# Altium schematic sheet JIANGYA.SchDoc
size OrCAD E
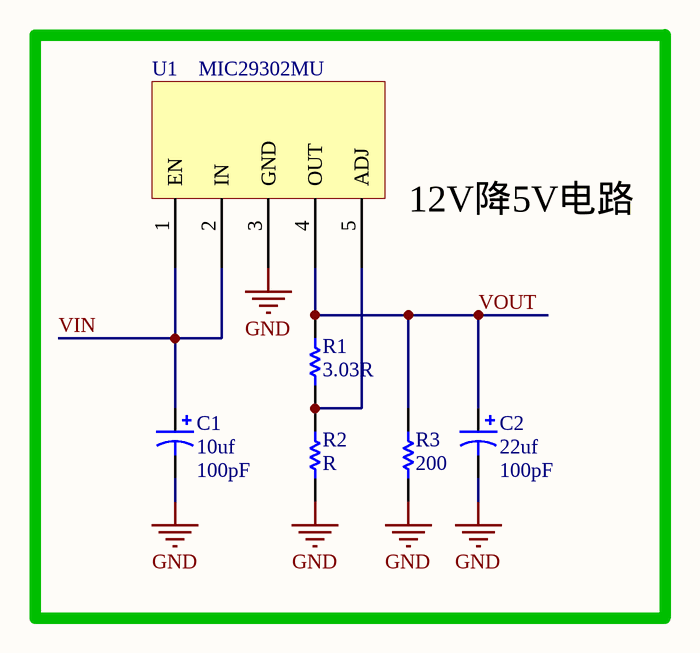
[diagram p0: JIANGYA.SchDoc]

## Parts
C1  10uf  value 100pF  [RB7.6-15]
C2  22uf  value 100pF  [RB7.6-15]
R1  3.03R  [AXIAL-0.3]
R2  R  [AXIAL-0.3]
R3  200  [AXIAL-0.3]
U1  MIC29302MU  [TO263-5]

## Blocks framed on the sheet
12V降5V电路: C1 C2 R1-R3 U1

## Nets
GND: C1.2 C2.2 R2.1 R3.1 U1.3(GND)
VIN: C1.1 U1.1(EN) U1.2(IN)
VOUT: C2.1 R1.2 R3.2 U1.4(OUT)
NetR1_1: R1.1 R2.2 U1.5(ADJ)

## Library data of the parts
C1 C2 = Cap Pol1: Polarized Capacitor (Radial); Published: 8-Jun-2000; LatestRevisionDate: 17-Jul-2002; LatestRevisionNote: Re-released for DXP Platform.; PackageReference: RB7.6-15; Publisher: Altium Limited; PackageDescription: Polarized Capacitor (Radial); 2 Leads
R1-R3 = Res1: Resistor; Value: 1K; Published: 8-Jun-2000; LatestRevisionDate: 17-Jul-2002; LatestRevisionNote: Re-released for DXP Platform.; PackageReference: AXIAL-0.3; Publisher: Altium Limited; PackageDescription: Axial Device, Thru-Hole; 2 Leads; 0.3 in Pin Spacing
U1 = Component_1